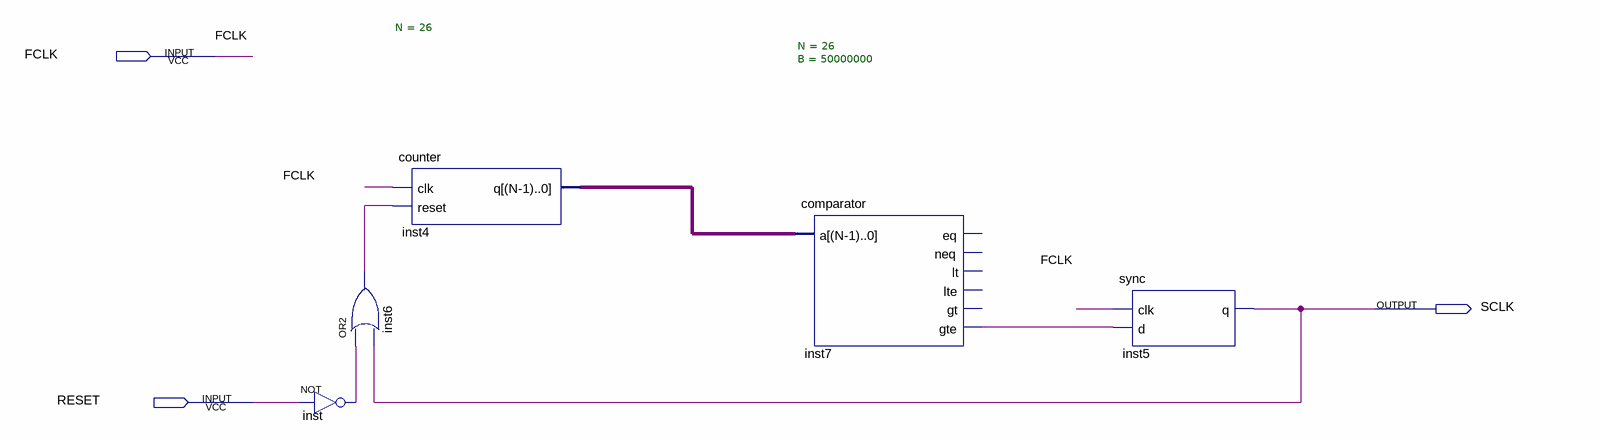
[diagram p0: schematic sheet]
// Quartus schematic SecondCLK.bdf as structural Verilog: 5 symbols, 3 pins
module SecondCLK (
  input  FCLK,
  input  RESET,
  output SCLK
);

  wire inst6_out, inst7_gte, inst_out;
  wire [25:0] inst4_q;

  or inst6 (inst6_out, inst_out, SCLK);
  not inst (inst_out, RESET);
  counter #(.N(26)) inst4 (.clk(FCLK), .reset(inst6_out), .q(inst4_q));
  comparator #(.N(26), .B(50000000)) inst7 (.a(inst4_q), .gte(inst7_gte));  // open: eq, neq, lt, lte, gt
  sync inst5 (.clk(FCLK), .d(inst7_gte), .q(SCLK));
endmodule
